# Altium schematic sheet I2C Block Diagram.SchDoc: I2C Network Block Diagram
size 292 x 193 mm; SheetNumber: 19; SheetTotal: 27
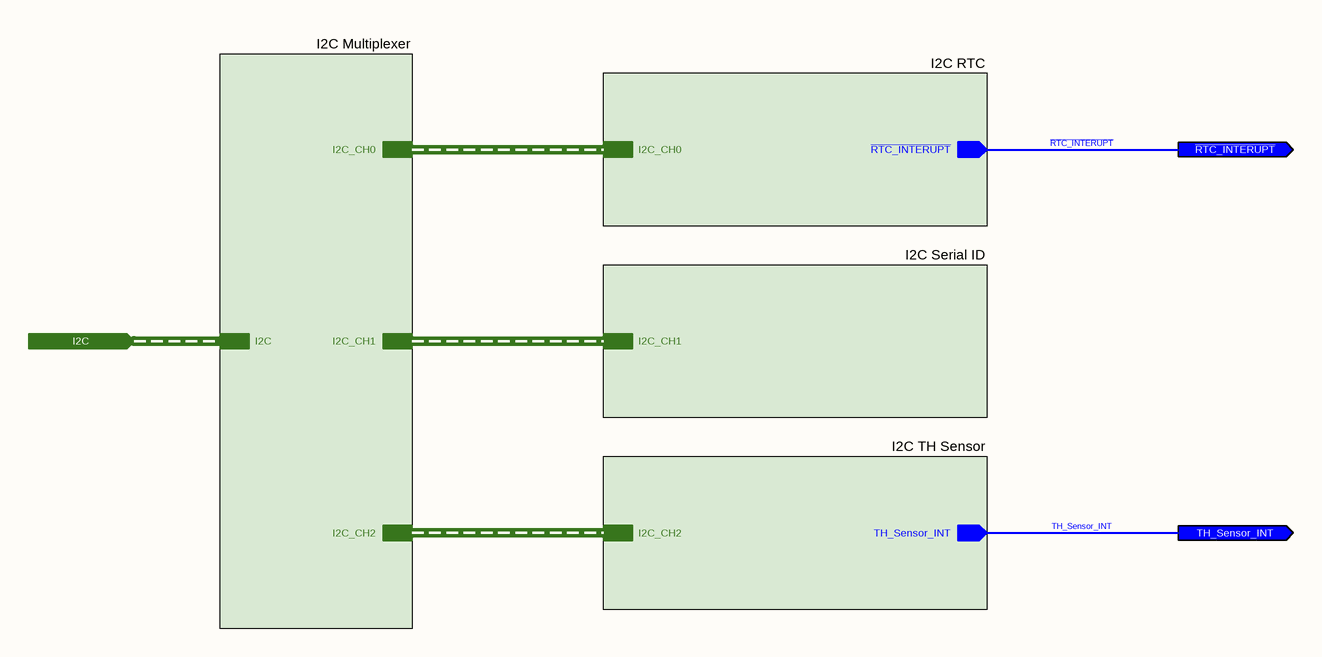
[diagram p0: I2C Block Diagram.SchDoc]

## Sub-sheets
I2C Multiplexer = I2C Multiplexer.SchDoc: I2C (harness I2C), I2C_CH2 (harness I2C_CH2), I2C_CH1 (harness I2C_CH1), I2C_CH0 (harness I2C_CH0)
I2C RTC = I2C Real Time Clock.SchDoc: ~{RTC_INTERUPT} (out), I2C_CH0 (harness I2C_CH0)
I2C Serial ID = I2C Serial ID EEPROM.SchDoc: I2C_CH1 (harness I2C_CH1)
I2C TH Sensor = I2C Temperature Sensor.SchDoc: TH_Sensor_INT (out), I2C_CH2 (harness I2C_CH2)

## Ports
I2C (in, harness I2C), TH_Sensor_INT (out), ~{RTC_INTERUPT} (out)

## Nets
~{RTC_INTERUPT}: port ~{RTC_INTERUPT}, sheet I2C RTC/~{RTC_INTERUPT}
TH_Sensor_INT: port TH_Sensor_INT, sheet I2C TH Sensor/TH_Sensor_INT

## Buses and harness runs
harness port I2C = sheet I2C Multiplexer/I2C
harness sheet I2C Multiplexer/I2C_CH0 = sheet I2C RTC/I2C_CH0
harness sheet I2C Multiplexer/I2C_CH1 = sheet I2C Serial ID/I2C_CH1
harness sheet I2C Multiplexer/I2C_CH2 = sheet I2C TH Sensor/I2C_CH2

## Notes on the sheet
- © 2021 All rights reserved.
  This document may not, in whole or in part, be copied, photocopied, reproduced, translated or converted to any electronic or machine readable from without prior written permission of Mehmet Günce Akkoyun.
  Engineer contact : akkoyun@me.com
- Property of
- Engineer :
- Date :
- Size :
- A4
- Time :
- Project :
- Page :
- /
- Customer :
- Product ID :
- Module ID :
- Version :
- File :
- Revision :